# EAGLE design controller (EAGLE 9.2.0)
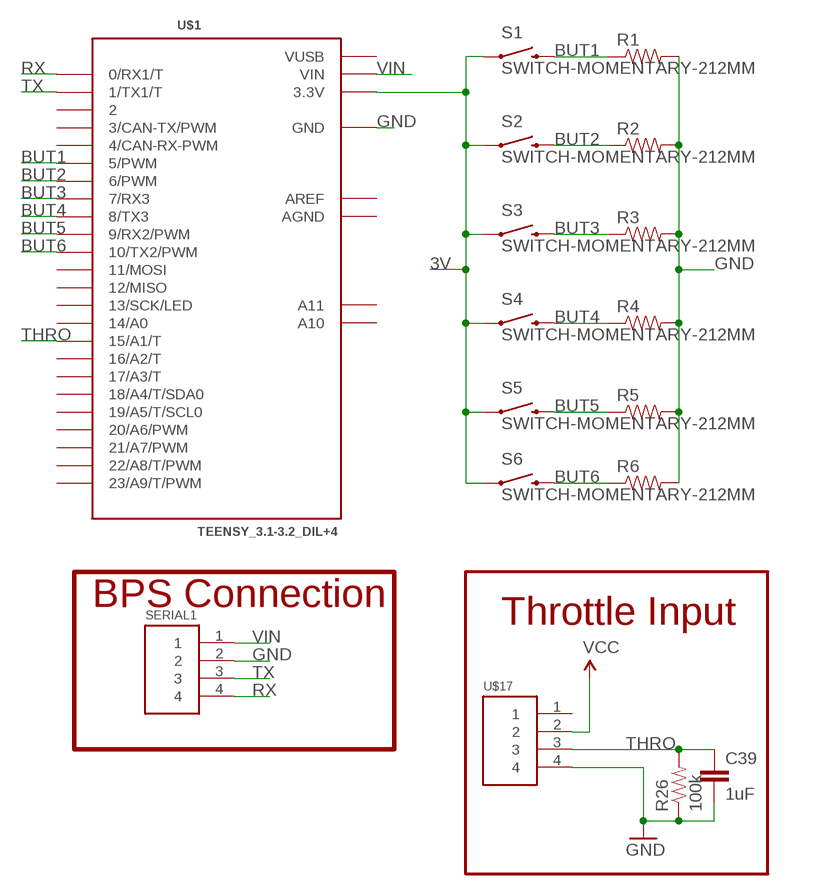
[diagram p0: schematic, sheet 1]

## Parts
C39  1uF  CAP0603-CAP  [0603-CAP]
R1  RESISTOR0603-RES  [0603-RES]
R2  RESISTOR0603-RES  [0603-RES]
R3  RESISTOR0603-RES  [0603-RES]
R4  RESISTOR0603-RES  [0603-RES]
R5  RESISTOR0603-RES  [0603-RES]
R6  RESISTOR0603-RES  [0603-RES]
R26  100k  RESISTOR0603-RES  [0603-RES]
S1  SWITCH-MOMENTARY-212MM  [TACTILE-PTH-12MM]
S2  SWITCH-MOMENTARY-212MM  [TACTILE-PTH-12MM]
S3  SWITCH-MOMENTARY-212MM  [TACTILE-PTH-12MM]
S4  SWITCH-MOMENTARY-212MM  [TACTILE-PTH-12MM]
S5  SWITCH-MOMENTARY-212MM  [TACTILE-PTH-12MM]
S6  SWITCH-MOMENTARY-212MM  [TACTILE-PTH-12MM]
SERIAL1  HEADER4VALULOK  [4PINVALULOK]
U$1  TEENSY_3.1-3.2_DIL+4  [TEENSY_3.0-3.2&LC_DIL+4]
U$17  HEADER4VALULOK  [4PINVALULOK]

## Nets
3V: S1.1 S2.1 S3.1 S4.1 S5.1 S6.1 U$1.3.3V U$17.2 ; supply symbol labelled VCC
BUT1: R1.1 S1.3 U$1.5(5/PWM)
BUT2: R2.1 S2.3 U$1.6(6/PWM)
BUT3: R3.1 S3.3 U$1.7(7/RX3)
BUT4: R4.1 S4.3 U$1.8(8/TX3)
BUT5: R5.1 S5.3 U$1.9(9/RX2/PWM)
BUT6: R6.1 S6.3 U$1.10(10/TX2/PWM)
GND: C39.2 R1.2 R2.2 R3.2 R4.2 R5.2 R6.2 R26.1 SERIAL1.2 U$1.GND U$17.4
RX: SERIAL1.4 U$1.0(0/RX1/T)
THRO: C39.1 R26.2 U$1.15/A1(15/A1/T) U$17.3
TX: SERIAL1.3 U$1.1(1/TX1/T)
VIN: SERIAL1.1 U$1.VIN
Unconnected: U$1.2 U$1.3(3/CAN-TX/PWM) U$1.4(4/CAN-RX-PWM) U$1.11(11/MOSI) U$1.12(12/MISO) U$1.13(13/SCK/LED) U$1.14/A0 U$1.16/A2(16/A2/T) U$1.17/A3(17/A3/T) U$1.18/A4(18/A4/T/SDA0) U$1.19/A5(19/A5/T/SCL0) U$1.20/A6(20/A6/PWM) U$1.21/A7(21/A7/PWM) U$1.22/A8(22/A8/T/PWM) U$1.23/A9(23/A9/T/PWM) U$1.A10 U$1.A11 U$17.1

## Notes on the sheet
- BPS Connection
- Throttle Input

## Power pins joined to a net without a drawn wire
AGND: U$1.AGND
AREF: U$1.AREF
VUSB: U$1.VUSB

## Library data of the parts
C39 = SparkFun-Passives:CAP: Capacitor Standard 0603 ceramic capacitor, and 0.1" leaded capacitor.
R1-R6 R26 = SparkFun-Passives:RESISTOR: Resistor Basic schematic elements and footprints for 0603, 1206, and PTH resistors.
S1-S6 = SparkFun-Electromechanical:SWITCH-MOMENTARY-2: Various NO switches- pushbuttons, reed, etc; PROD_ID: SWCH-09185
SERIAL1 U$17 = Custom_old:HEADER4
U$1 = Teensy:TEENSY_3.1-3.2_DIL+4: Teensy 3.1 and 3.2 in a DIL package with the inner 4 pins

## Board
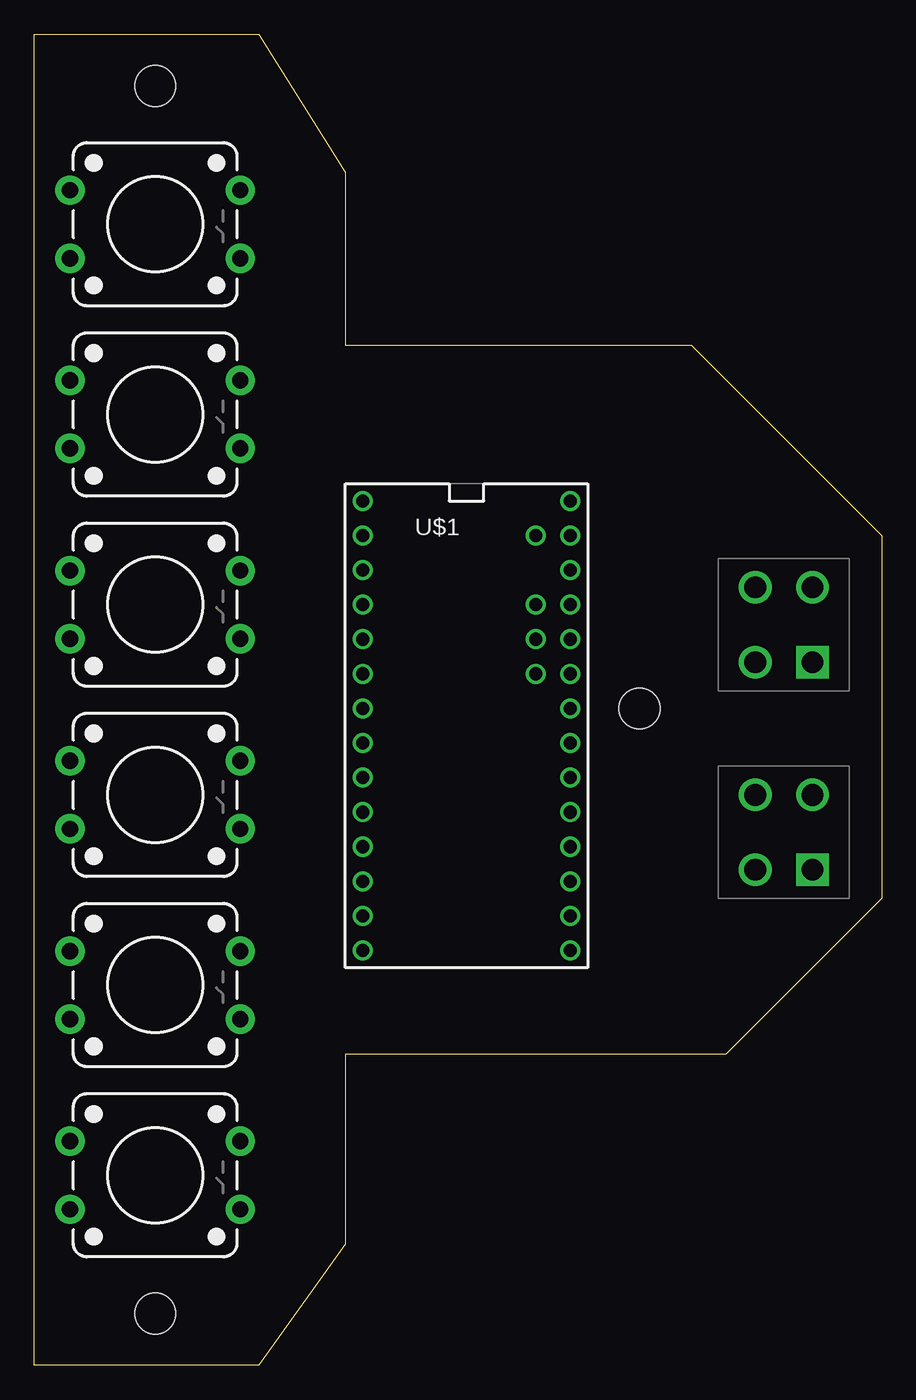
[diagram p1: board, top side]
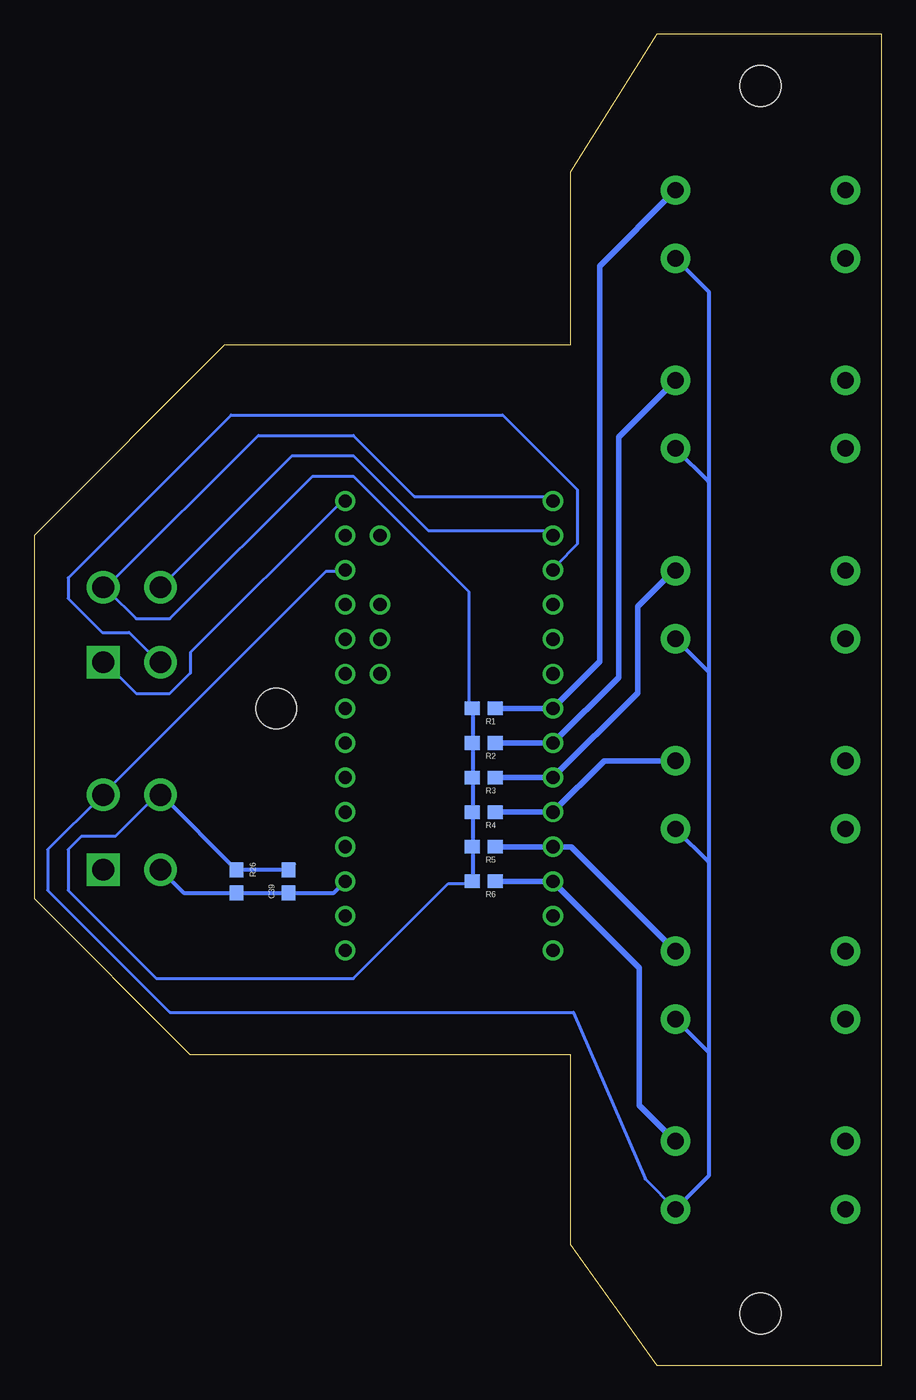
[diagram p2: board, bottom side, seen from below]

Size 62.23 x 97.79 mm. Coordinates in mm from the lower left corner, seen from the top.
Outline: 0,0 0,97.79 16.51,97.79 22.86,87.63 22.86,74.93 48.26,74.93 62.23,60.96 62.23,34.29 50.8,22.86 22.86,22.86 22.86,8.89 16.51,0 0,0
Copper layers (1*16): Top 0.035mm / dielectric 1.5mm / Bottom 0.035mm
Design rules "OthermillDRC_1_32_v2": minimum track width 8mil, minimum drill 0.8mm, track to track 0.794003125mm, track to pad 0.794003125mm, pad to pad 0.794003125mm, via to via 0.794003125mm, smd to smd 0mil, copper to edge 0mil, drill to drill 1mil, minimum pad ring 10mil, minimum via ring 10mil, stop-mask expansion 1mil, vias tented up to drill 30mil, thermal gap 10mil
Holes 3 mm at 8.89,93.98 8.89,3.81 44.45,48.26

### Footprints (pad centres in the part's own frame; a part is rotated, then mirrored left to right if it is on the bottom)
0603-CAP = smd 1.1 x 1: 1 -0.85,0; 2 0.85,0
0603-RES = smd 1.1 x 1: 1 -0.85,0; 2 0.85,0
TACTILE-PTH-12MM = drill 1.2 pad 2.159: 1 6.25,-2.5; 2 -6.25,-2.5; 3 6.25,2.5; 4 -6.25,2.5
4PINVALULOK = drill 1.6 square: 1 0,5.5 | drill 1.6: 2 0,0; 3 4.2,5.5; 4 4.2,0
TEENSY_3.0-3.2&LC_DIL+4 = drill 0.965: 0 -7.62,13.97; 1 -7.62,11.43; 2 -7.62,8.89; 3 -7.62,6.35; 3.3V 7.62,11.43; 4 -7.62,3.81; 5 -7.62,1.27; 6 -7.62,-1.27; 7 -7.62,-3.81; 8 -7.62,-6.35; 9 -7.62,-8.89; 10 -7.62,-11.43; 11 -7.62,-13.97; 12 -7.62,-16.51; 13 7.62,-16.51; 14/A0 7.62,-13.97; 15/A1 7.62,-11.43; 16/A2 7.62,-8.89; 17/A3 7.62,-6.35; 18/A4 7.62,-3.81; 19/A5 7.62,-1.27; 20/A6 7.62,1.27; 21/A7 7.62,3.81; 22/A8 7.62,6.35; 23/A9 7.62,8.89; A10 5.08,6.35; A11 5.08,3.81; AGND 7.62,13.97; AREF 5.08,8.89; GND -7.62,16.51; VIN 7.62,16.51; VUSB 5.08,13.97

### Placement (x,y rotation side)
C39  43.56,35.56 90 bottom
R1  29.21,48.26 180 bottom
R2  29.21,45.72 180 bottom
R3  29.21,43.18 180 bottom
R4  29.21,40.64 180 bottom
R5  29.21,38.1 180 bottom
R6  29.21,35.56 180 bottom
R26  47.37,35.56 270 bottom
S1  8.89,83.82 0 top
S2  8.89,69.85 0 top
S3  8.89,55.88 0 top
S4  8.89,41.91 0 top
S5  8.89,27.94 0 top
S6  8.89,13.97 0 top
SERIAL1  57.15,57.15 180 top
U$1  31.75,46.99 0 top
U$17  57.15,41.91 180 top

### Tracks (layer width: path | path; a pad name or v marks a point on that pad's centre or on a via)
3V
  Bottom 0.203: U$1.3.3V 39.78,58.34 40.78,58.34 56.74,42.38 U$17.2 57.24,41.88 61.23,37.89 61.23,34.9 52.26,25.94 22.63,25.94 17.37,13.7 S6.1
  Bottom 0.305: S6.1 12.7,13.91 12.7,23 | S5.1 12.7,23 | 12.7,36.97 12.7,23 | S4.1 12.7,36.97 | 12.7,50.94 12.7,36.97 | S3.1 12.7,50.94 | 12.7,64.91 12.7,50.94 | S2.1 12.7,64.91 | 12.7,64.91 12.7,78.88 S1.1
BUT1
  Bottom 0.406: R1.1 U$1.5 20.7,51.69 20.7,80.76 S1.3
BUT2
  Bottom 0.406: R2.1 U$1.6 19.3,50.55 19.3,68.19 S2.3
BUT3
  Bottom 0.406: R3.1 U$1.7 17.91,49.4 17.91,55.75 15.28,58.38 S3.3
BUT4
  Bottom 0.406: R4.1 U$1.8 20.36,44.41 S4.3
BUT5
  Bottom 0.406: R5.1 U$1.9 22.8,38.1 S5.3
BUT6
  Bottom 0.406: R6.1 U$1.10 17.78,29.21 17.78,19.11 S6.3
GND
  Bottom 0.152: 30.02,48.16 R1.2 30.02,48.31 | R6.2 30.02,35.66 | 30.02,40.69 R4.2 30.02,40.54 | 30.02,43.13 R3.2 30.02,43.28 | R5.2 30.02,38.1 | R2.2 30.02,45.72 | 43.59,36.42 C39.2 43.43,36.42 43.28,36.58 | 47.24,36.42 R26.1 47.4,36.42 | U$17.4 52.88,41.91
  Bottom 0.203: U$17.4 53.25,41.88 56.24,38.89 58.73,38.89 59.73,37.89 59.73,34.9 53.25,28.42 38.79,28.42 31.81,35.4 30.31,35.4 R6.2 | U$1.GND 24.33,63.82 34.3,63.82 38.79,68.31 45.77,68.31 56.74,57.34 SERIAL1.2 56.74,56.84 54.74,54.85 52.25,54.85 41.78,65.32 38.79,65.32 30.31,56.84 30.31,48.36 R1.2
  Bottom 0.305: 30.02,48.16 30.02,45.72 30.02,43.28 | 30.02,35.66 30.02,38.1 30.02,40.54 | 30.02,43.13 30.02,40.69 | 43.14,36.83 C39.2 43.58,36.42 47.24,36.42 | R26.1 52.87,41.91 U$17.4
RX
  Bottom 0.203: U$1.0 24.33,61.33 33.3,61.33 38.79,66.81 43.27,66.81 52.75,57.34 SERIAL1.4
THRO
  Bottom 0.152: 43.59,34.75 C39.1 43.43,34.75 | 47.24,34.75 R26.2 47.4,34.75
  Bottom 0.305: U$1.15/A1 40.22,34.71 C39.1 R26.2 51.25,34.71 U$17.3
TX
  Bottom 0.203: U$1.1 23.83,58.84 22.33,60.33 22.33,64.32 27.82,69.8 47.76,69.8 59.73,57.84 59.73,56.34 57.24,53.85 55.24,53.85 53.25,51.85 SERIAL1.3
VIN
  Bottom 0.203: U$1.VIN 39.78,63.32 50.75,52.35 50.75,50.86 52.25,49.36 54.74,49.36 56.74,51.36 SERIAL1.1